# Altium schematic sheet Sheet_Ninja_ECU.SchDoc
size A
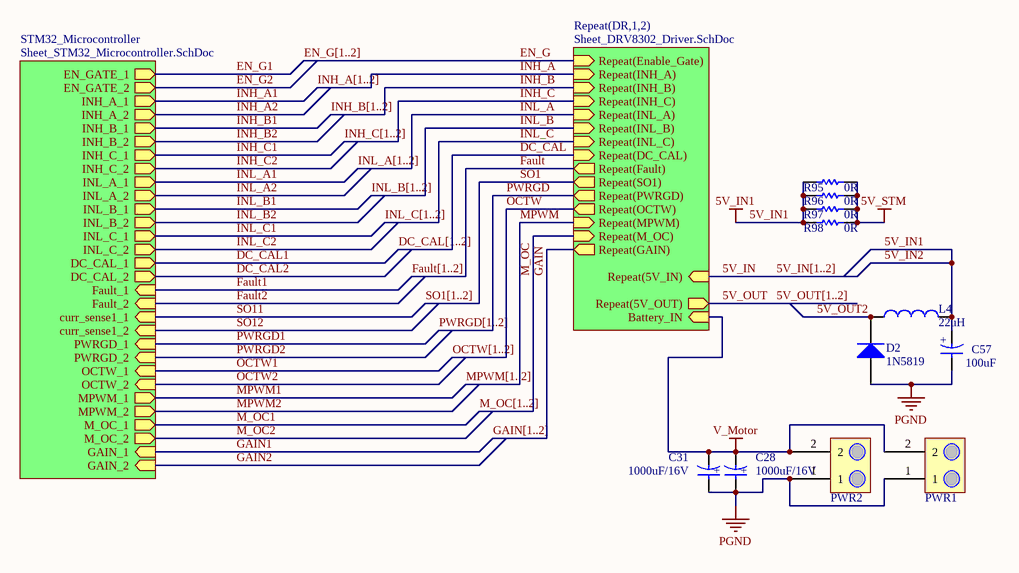
[diagram p0: Sheet_Ninja_ECU.SchDoc]

## Parts
C28  1000uF/16V  [UUG_Series_Cap]
C31  1000uF/16V  [UUG_Series_Cap]
C57  100uF  [UWT_Series_Cap]
D2  1N5819  [DIODE-3]
L4  22uH  [SDR0805]
PWR1  Computer Power  [TERM2]  (value not drawn)
PWR2  Battery Power  [TERM2]  (value not drawn)
R95  0R  [2012[0805]]
R96  0R  [2012[0805]]
R97  0R  [2012[0805]]
R98  0R  [2012[0805]]

## Sub-sheets
Repeat(DR,1,2) = Sheet_DRV8302_Driver.SchDoc: Repeat(INH_A) (in), Repeat(Enable_Gate) (in), Repeat(DC_CAL) (in), Repeat(GAIN) (out), Repeat(M_OC) (in), Repeat(MPWM) (in), Repeat(PWRGD) (out), Repeat(SO1) (out), Repeat(OCTW) (out), Repeat(Fault) (out), Repeat(INL_C) (in), Repeat(INH_C) (in), Repeat(INL_B) (in), Repeat(INH_B) (in), Repeat(INL_A) (in), Repeat(5V_OUT) (out), Repeat(5V_IN) (in), Battery_IN (in)
STM32_Microcontroller = Sheet_STM32_Microcontroller.SchDoc: OCTW_1 (in), PWRGD_1 (in), Fault_1 (in), MPWM_1 (out), M_OC_1 (out), GAIN_1 (in), DC_CAL_1 (out), curr_sense1_1 (in), EN_GATE_1 (out), INH_A_1 (out), INL_A_1 (out), INH_C_1 (out), INL_C_1 (out), INH_B_1 (out), INL_B_1 (out), INH_A_2 (out), INL_A_2 (out), EN_GATE_2 (out), INH_B_2 (out), INL_B_2 (out), INH_C_2 (out), INL_C_2 (out), MPWM_2 (out), M_OC_2 (out), GAIN_2 (in), DC_CAL_2 (out), Fault_2 (in), curr_sense1_2 (in), OCTW_2 (in), PWRGD_2 (in)

## Nets
5V_IN1: C57.2 L4.2 R95.1 R96.1 R97.1 R98.1  [also labelled 5V_IN2]
5V_STM: R95.2 R96.2 R97.2 R98.2
PGND: C28.1 C31.1 C57.1 D2.1(A) PWR1.1 PWR2.1
V_Motor: C28.2 C31.2 PWR1.2 PWR2.2 ; sheet Repeat(DR,1,2)/Battery_IN
5V_IN: sheet Repeat(DR,1,2)/Repeat(5V_IN)
5V_OUT: sheet Repeat(DR,1,2)/Repeat(5V_OUT)
5V_OUT2: D2.2(K) L4.1
DC_CAL: sheet Repeat(DR,1,2)/Repeat(DC_CAL)
DC_CAL1: sheet STM32_Microcontroller/DC_CAL_1
DC_CAL2: sheet STM32_Microcontroller/DC_CAL_2
EN_G: sheet Repeat(DR,1,2)/Repeat(Enable_Gate)
EN_G1: sheet STM32_Microcontroller/EN_GATE_1
EN_G2: sheet STM32_Microcontroller/EN_GATE_2
Fault: sheet Repeat(DR,1,2)/Repeat(Fault)
Fault1: sheet STM32_Microcontroller/Fault_1
Fault2: sheet STM32_Microcontroller/Fault_2
GAIN: sheet Repeat(DR,1,2)/Repeat(GAIN)
GAIN1: sheet STM32_Microcontroller/GAIN_1
GAIN2: sheet STM32_Microcontroller/GAIN_2
INH_A: sheet Repeat(DR,1,2)/Repeat(INH_A)
INH_A1: sheet STM32_Microcontroller/INH_A_1
INH_A2: sheet STM32_Microcontroller/INH_A_2
INH_B: sheet Repeat(DR,1,2)/Repeat(INH_B)
INH_B1: sheet STM32_Microcontroller/INH_B_1
INH_B2: sheet STM32_Microcontroller/INH_B_2
INH_C: sheet Repeat(DR,1,2)/Repeat(INH_C)
INH_C1: sheet STM32_Microcontroller/INH_C_1
INH_C2: sheet STM32_Microcontroller/INH_C_2
INL_A: sheet Repeat(DR,1,2)/Repeat(INL_A)
INL_A1: sheet STM32_Microcontroller/INL_A_1
INL_A2: sheet STM32_Microcontroller/INL_A_2
INL_B: sheet Repeat(DR,1,2)/Repeat(INL_B)
INL_B1: sheet STM32_Microcontroller/INL_B_1
INL_B2: sheet STM32_Microcontroller/INL_B_2
INL_C: sheet Repeat(DR,1,2)/Repeat(INL_C)
INL_C1: sheet STM32_Microcontroller/INL_C_1
INL_C2: sheet STM32_Microcontroller/INL_C_2
M_OC: sheet Repeat(DR,1,2)/Repeat(M_OC)
M_OC1: sheet STM32_Microcontroller/M_OC_1
M_OC2: sheet STM32_Microcontroller/M_OC_2
MPWM: sheet Repeat(DR,1,2)/Repeat(MPWM)
MPWM1: sheet STM32_Microcontroller/MPWM_1
MPWM2: sheet STM32_Microcontroller/MPWM_2
OCTW: sheet Repeat(DR,1,2)/Repeat(OCTW)
OCTW1: sheet STM32_Microcontroller/OCTW_1
OCTW2: sheet STM32_Microcontroller/OCTW_2
PWRGD: sheet Repeat(DR,1,2)/Repeat(PWRGD)
PWRGD1: sheet STM32_Microcontroller/PWRGD_1
PWRGD2: sheet STM32_Microcontroller/PWRGD_2
SO1: sheet Repeat(DR,1,2)/Repeat(SO1)
SO11: sheet STM32_Microcontroller/curr_sense1_1
SO12: sheet STM32_Microcontroller/curr_sense1_2

## Buses and harness runs
bus 5V_IN[1..2]
bus 5V_OUT[1..2]
bus DC_CAL[1..2]
bus EN_G[1..2]
bus Fault[1..2]
bus GAIN[1..2]
bus INH_A[1..2]
bus INH_B[1..2]
bus INH_C[1..2]
bus INL_A[1..2]
bus INL_B[1..2]
bus INL_C[1..2]
bus M_OC[1..2]
bus MPWM[1..2]
bus OCTW[1..2]
bus PWRGD[1..2]
bus SO1[1..2]

## Notes on the sheet
- (in symbol Cap_E) +

## Library data of the parts
C28 C31 C57 = Cap_E: Capacitor; Supplier 1: Digi-Key
  C28 C31: Value: 1000uF/16V; Supplier Part Number 1: 493-7429-1-ND
  C57: Value: 100uF; Supplier Part Number 1: 493-2203-1-ND
D2 = Diode: Value: ?; Supplier 1: Digi-Key; Supplier Part Number 1: 1N5819HW-FDICT-ND
L4 = Inductor: Value: 22uH; Supplier 1: Digi-Key; Supplier Part Number 1: SDR0805-220MLCT-ND
PWR1 PWR2 = Terminal2: Connector; Value: ?
R95-R98 = Res: Value: 0R; Supplier 1: Digi-Key; Supplier Part Number 1: 311-0.0ARCT-ND